# Altium schematic sheet TSL1401CS_SensorBoard.SchDoc
size A
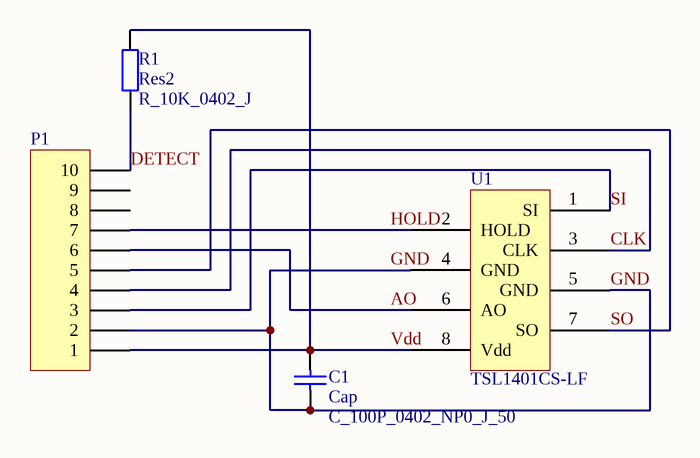
[diagram p0: TSL1401CS_SensorBoard.SchDoc]

## Parts
C1  Cap  value C_100P_0402_NP0_J_50  [C_0402]
P1  Header 10  [609-4377-ND]  (value not drawn)
R1  Res2  value R_10K_0402_J  [R_0402]
U1  TSL1401CS-LF  [TSL1401CS-LF solder bump linear array]

## Nets
AO: P1.6 U1.6(AO)
CLK: P1.4 U1.3(CLK)
DETECT: P1.10 R1.1
GND: C1.1(Vdd) P1.2 U1.4(GND) U1.5(GND)
HOLD: P1.7 U1.2(HOLD)
SI: P1.3 U1.1(SI)
SO: P1.5 U1.7(SO)
Vdd: C1.2(GND) P1.1 R1.2 U1.8(Vdd)

Not connected (* = marked no-connect by the designer): P1 8 9

## Library data of the parts
C1 = Cap: Capacitor; Published: 8-Jun-2000; LatestRevisionDate: 17-Jul-2002; LatestRevisionNote: Re-released for DXP Platform.; PackageReference: RAD-0.3; Publisher: Altium Limited; PackageDescription: Radial Cap, Thru-Hole; 2 Leads; 0.3 in Pin Spacing; Supplier 1: Digi-Key; Supplier Part Number 1: 490-3458-6-ND
P1 = Header 10: Header, 10-Pin; LatestRevisionDate: 17-Jul-2002; LatestRevisionNote: Re-released for DXP Platform.; Publisher: Altium Limited; Supplier 1: Digi-Key; Supplier Part Number 1: 609-4377-ND; Supplier 2: Mouser; Supplier Part Number 2: 649-10112690G0305ULF
R1 = Res2: Resistor; Published: 8-Jun-2000; LatestRevisionDate: 17-Jul-2002; LatestRevisionNote: Re-released for DXP Platform.; Publisher: Altium Limited; Supplier 1: Digi-Key; Supplier Part Number 1: P10KJCT-ND; Supplier 2: Mouser; Supplier Part Number 2: 667-ERJ-2GEJ103X